# Altium project UsbTtlBoard.PrjPcb
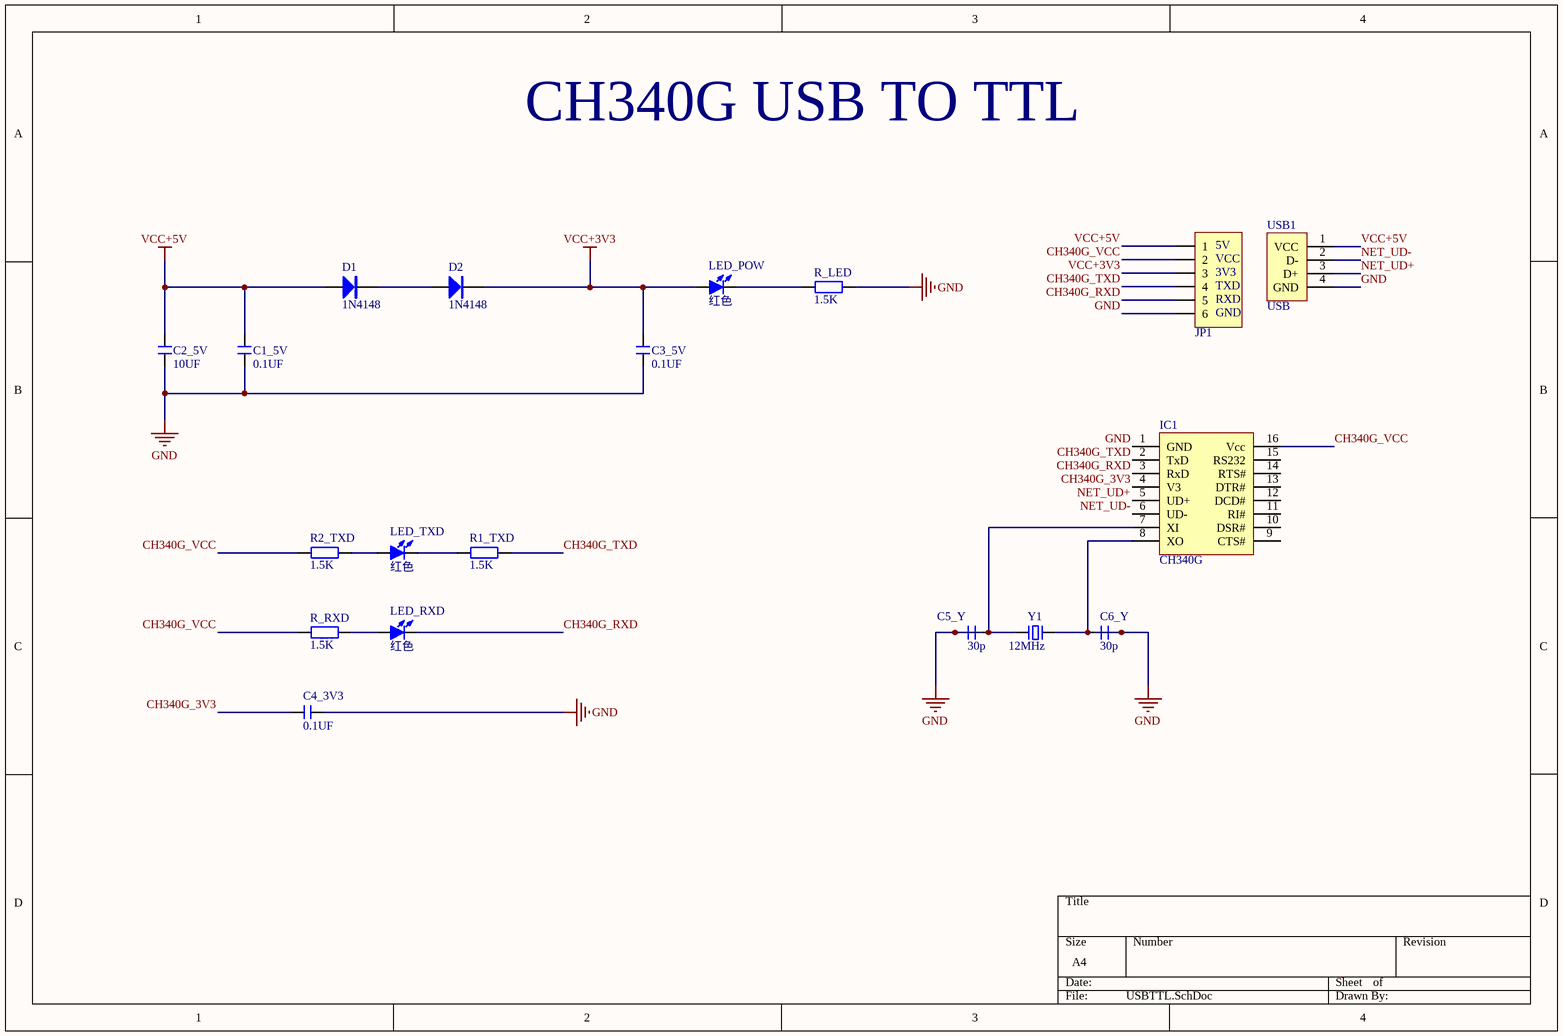
[diagram p0: USBTTL.SchDoc]
1 sheet, 19 parts. Net scope: global (net labels, ports and power ports of the same name join across sheets).
Board file: USBTTL.PcbDoc

## Sheet USBTTL.SchDoc
size A4; SheetNumber: 1; SheetTotal: 1; SPICEModelCacheZZNZTNEG: <root> / <DocumentId>ZZNZTNEG</DocumentId> / <CacheFrame Number="0"> / <Model Name="diode" Kind="MDL"> / <Text>.MODEL diode D ()</Text> / </Model> / </CacheFrame> / </root>

### Parts
C1_5V  0.1UF  [C 0603]
C2_5V  10UF  [C 0603]
C3_5V  0.1UF  [C 0603]
C4_3V3  0.1UF  [C 0603]
C5_Y  30p  [C 0603]
C6_Y  30p  [C 0603]
D1  1N4148  [MINI_MELF (LL34)]
D2  1N4148  [MINI_MELF (LL34)]
IC1  CH340G  [SOP16_L]
JP1  HDR-1X6  [HDR-1X6-USBTTL]  (value not drawn)
LED_POW  红色  [LED 0603R]
LED_RXD  红色  [LED 0603R]
LED_TXD  红色  [LED 0603R]
R1_TXD  1.5K  [R 0603]
R2_TXD  1.5K  [R 0603]
R_LED  1.5K  [R 0603]
R_RXD  1.5K  [R 0603]
USB1  USB  [USB_A/P_A]
Y1  12MHz  [XTAL-49S DIP]

### Nets
GND: C1_5V.1 C2_5V.1 C3_5V.1 C4_3V3.2 C5_Y.1 C6_Y.2 IC1.1(GND) JP1.6 R_LED.2 USB1.4(GND)
VCC+3V3: C3_5V.2 D2.2(K) JP1.3 LED_POW.1(A)
VCC+5V: C1_5V.2 C2_5V.2 D1.1(A) JP1.1 USB1.1(VCC)
CH340G_3V3: C4_3V3.1 IC1.4(V3)
CH340G_RXD: IC1.3(RxD) JP1.5 LED_RXD.2(K)
CH340G_TXD: IC1.2(TxD) JP1.4 R1_TXD.2
CH340G_VCC: IC1.16(Vcc) JP1.2 R2_TXD.1 R_RXD.1
NET_UD+: IC1.5(UD+) USB1.3(D+)
NET_UD-: IC1.6(UD-) USB1.2(D-)
NetC5_Y_2: C5_Y.2 IC1.7(XI) Y1.1
NetC6_Y_1: C6_Y.1 IC1.8(XO) Y1.2
NetD1_2: D1.2(K) D2.1(A)
NetLED_POW_2: LED_POW.2(K) R_LED.1
NetLED_RXD_1: LED_RXD.1(A) R_RXD.2
NetLED_TXD_1: LED_TXD.1(A) R2_TXD.2
NetLED_TXD_2: LED_TXD.2(K) R1_TXD.1

Not connected (* = marked no-connect by the designer): IC1 9(CTS#) 10(DSR#) 11(RI#) 12(DCD#) 13(DTR#) 14(RTS#) 15(RS232)

### Notes on the sheet
- CH340G USB TO TTL
- (in symbol Header 6_USBTTL) 5V; VCC; 3V3; TXD; RXD; GND

### Library data of the parts
C1_5V C2_5V C3_5V C4_3V3 C5_Y C6_Y = C: 无极性贴片电容; 版权归属: 源创客; Value: 1n; BOM名称: 无极性贴片电容; 学习资源: www.ooocke.com
D1 D2 = 1N4148: 高速开关二极管; 版权归属: 源创客; BOM名称: 高速开关二极管; 学习资源: www.ooocke.com
IC1 = CH340G: 串口转USB; 版权归属: 源创客; BOM名称: 串口转USB; 学习资源: www.ooocke.com
JP1 = Header 6_USBTTL: 6P接插件; 版权归属: 源创客; BOM名称: 6P接插件; 学习资源: www.ooocke.com
LED_POW LED_RXD LED_TXD = LED-SMD: 贴片LED; 版权归属: 源创客; Value: 1u; BOM名称: 贴片LED; 学习资源: www.ooocke.com
R1_TXD R2_TXD R_LED R_RXD = R: 贴片电阻; 版权归属: 源创客; Value: 1K; BOM名称: 贴片电阻; 学习资源: www.ooocke.com
USB1 = USB-A/P: USB-A型公接口; 版权归属: 源创客; BOM名称: USB-A型公接口; 学习资源: www.ooocke.com
Y1 = XTAL-2: 2脚晶振; 版权归属: 源创客; BOM名称: 2脚晶振; 学习资源: www.ooocke.com